# EasyEDA Pro project USB Hub.epro

# Schematic Schematic1
Board Name: Board1; Create Date: 2026-03-24; Page Name: P1; Project Name: USB Hub; Schematic Name: Schematic1; Update Date: 2026-03-24; Company: EasyEDA.com; Page Size: A4; Version: V1.0
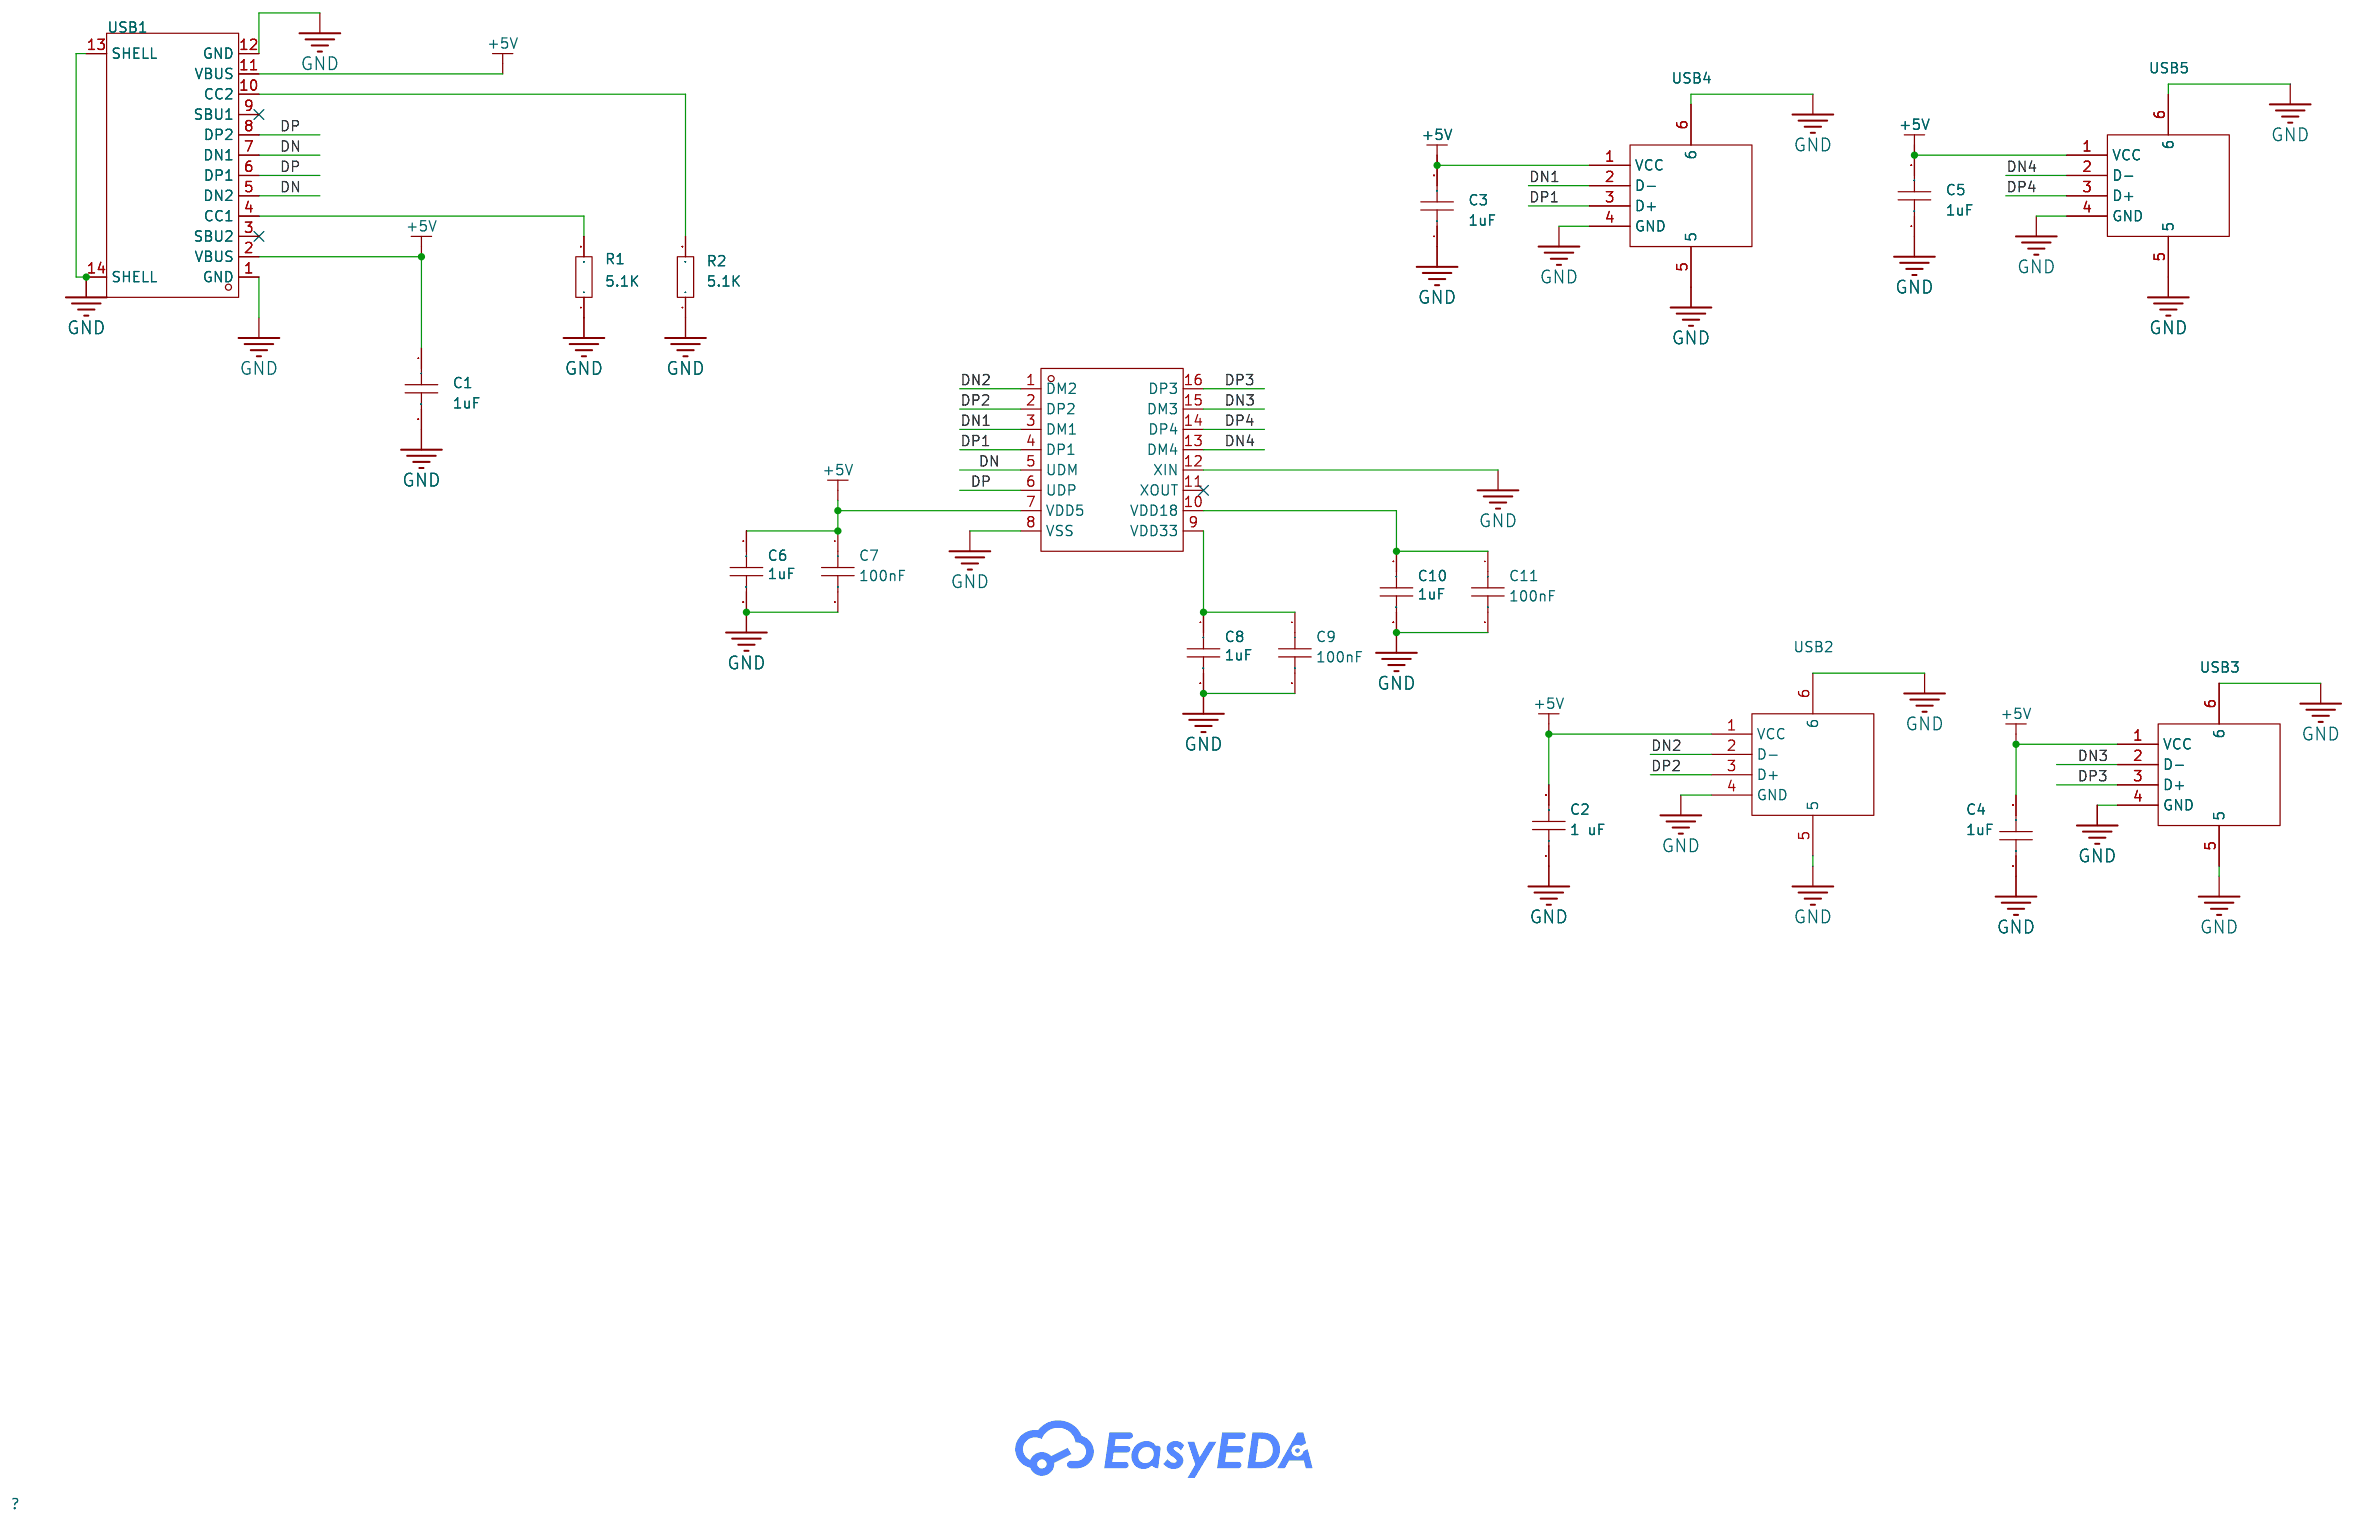
[diagram p0: schematic sheet]

## Parts
C1  100nF  [C0603]
C2  1 uF  [C0603]
C3  100nF  [C0603]
C4  100nF  [C0603]
C5  100nF  [C0603]
C6  100nF  [C0603]
C7  100nF  [C0603]
C8  100nF  [C0603]
C9  100nF  [C0603]
C10  100nF  [C0603]
C11  100nF  [C0603]
R1  10K  [R0603]
R2  10K  [R0603]
U1  SL2.1s  [SSOP-16_L4.6-W2.6-P0.53-LS4.0-BL]
USB1  TYPE-C 16PIN 2MD(073)  [USB-C-SMD_TYPE-C-6PIN-2MD-073]
USB2  10.0 QHHTZB6.3  [USB-A-TH_10.0QHHTZB6.3]
USB3  10.0 QHHTZB6.3  [USB-A-TH_10.0QHHTZB6.3]
USB4  10.0 QHHTZB6.3  [USB-A-TH_10.0QHHTZB6.3]
USB5  10.0 QHHTZB6.3  [USB-A-TH_10.0QHHTZB6.3]

## Library data of the parts
C1-C11 = CAP_0603: Supplier Footprint: 0603
R1 R2 = Res_0603: Supplier Footprint: 0603
U1 = SL2.1s: type:Hub USB Protocol:USB 2.0 Voltage - Supply:4V~5.25V Voltage - Supply:4V~5.25V Operating Temperature:0℃~+70℃ Operating Temperature:0℃~+70℃ Current - Supply:120mA Quiescent Supply Current:2.5mA Number of Channels:4; LCSC Part Name: USB2.0 HUB控制器集成电路; Supplier Part: C2684433; Manufacturer: CoreChips(和芯润德); Supplier Footprint: SSOP-16; JLCPCB Part Class: Extended Part; Datasheet: https://item.szlcsc.com/datasheet/SL2.1s/2782346.html; Supplier: LCSC; type: Hub; USB Protocol: USB 2.0; Voltage - Supply: 4V~5.25V; Operating Temperature: 0℃~+70℃; Current - Supply: 120mA; Quiescent Supply Current: 2.5mA; Number of Channels: 4
USB1 = TYPE-C 16PIN 2MD(073): Connector Type:Type-C Protocol Standard:- Gender:Female Mounting Type:Surface Mount, Right Angle Number of Contacts:16P Number of Ports:1 Current Rating-Power:3A Voltage Rating:5V Connect-Disconnect Life:5,000 times Supplementary Features:- Center Height:; LCSC Part Name: 16P卧贴母座; Supplier Part: C2765186; Manufacturer: SHOU HAN(首韩); Supplier Footprint: SMD; JLCPCB Part Class: Extended Part; Datasheet: https://item.szlcsc.com/datasheet/TYPE-C%252016PIN%25202MD(073)/2901843.html; Supplier: LCSC; Connector Type: Type-C; Gender: Female; Mounting Type: Surface Mount, Right Angle; Number of Contacts: 16P; Number of Ports: 1; Current Rating-Power: 3A; Voltage Rating: 5V; Connect-Disconnect Life: 5,000 times; Detection color: Black; Operating Temperature: -25℃~+85℃
USB2-USB5 = 10.0 QHHTZB6.3: Connector Type:Type-A Protocol Standard:USB 2.0 Gender:Female Mounting Type:Surface Mount, Right Angle Number of Contacts:4P Number of Ports:1 Current Rating-Power:1.5A Voltage Rating:30V Connect-Disconnect Life:5,000 times Supplementary Features:- Center; LCSC Part Name: 壳长10.0mm; Supplier Part: C668591; Manufacturer: SHOU HAN(首韩); Supplier Footprint: SMD; JLCPCB Part Class: Extended Part; Datasheet: https://item.szlcsc.com/datasheet/10.0%2520QHHTZB6.3/698534.html; Supplier: LCSC; Connector Type: Type-A; Protocol Standard: USB 2.0; Gender: Female; Mounting Type: Surface Mount, Right Angle; Number of Contacts: 4P; Number of Ports: 1; Current Rating-Power: 1.5A; Voltage Rating: 30V; Connect-Disconnect Life: 5,000 times; Length: 10mm; Detection color: Black; Operating Temperature: -25℃~+85℃

## Nets
+5V: C1.1 C2.2 C3.2 C4.2 C5.2 C6.1 C7.1 U1.7(VDD5) USB1.2(VBUS) USB1.11(VBUS) USB2.1(VCC) USB3.1(VCC) USB4.1(VCC) USB5.1(VCC)
GND: C1.2 C2.1 C3.1 C4.1 C5.1 C6.2 C7.2 C8.2 C9.2 C10.2 C11.2 R1.1 R2.1 U1.8(VSS) U1.12(XIN) USB1.1(GND) USB1.12(GND) USB1.13(SHELL) USB1.14(SHELL) USB2.4(GND) USB2.5 USB2.6 USB3.4(GND) USB3.5 USB3.6 USB4.4(GND) USB4.5 USB4.6 USB5.4(GND) USB5.5 USB5.6
DN: U1.5(UDM) USB1.5(DN2) USB1.7(DN1)
DN1: U1.3(DM1) USB4.2(D-)
DN2: U1.1(DM2) USB2.2(D-)
DN3: U1.15(DM3) USB3.2(D-)
DN4: U1.13(DM4) USB5.2(D-)
DP: U1.6(UDP) USB1.6(DP1) USB1.8(DP2)
DP1: U1.4(DP1) USB4.3(D+)
DP2: U1.2(DP2) USB2.3(D+)
DP3: U1.16(DP3) USB3.3(D+)
DP4: U1.14(DP4) USB5.3(D+)
$1N2464: C8.1 C9.1 U1.9(VDD33)
$1N2541: C10.1 C11.1 U1.10(VDD18)
$1N2759: R1.2 USB1.4(CC1)
$1N2783: R2.2 USB1.10(CC2)

Not connected (* = marked no-connect by the designer): U1 11(XOUT)*; USB1 3(SBU2)* 9(SBU1)*

# Board PCB1
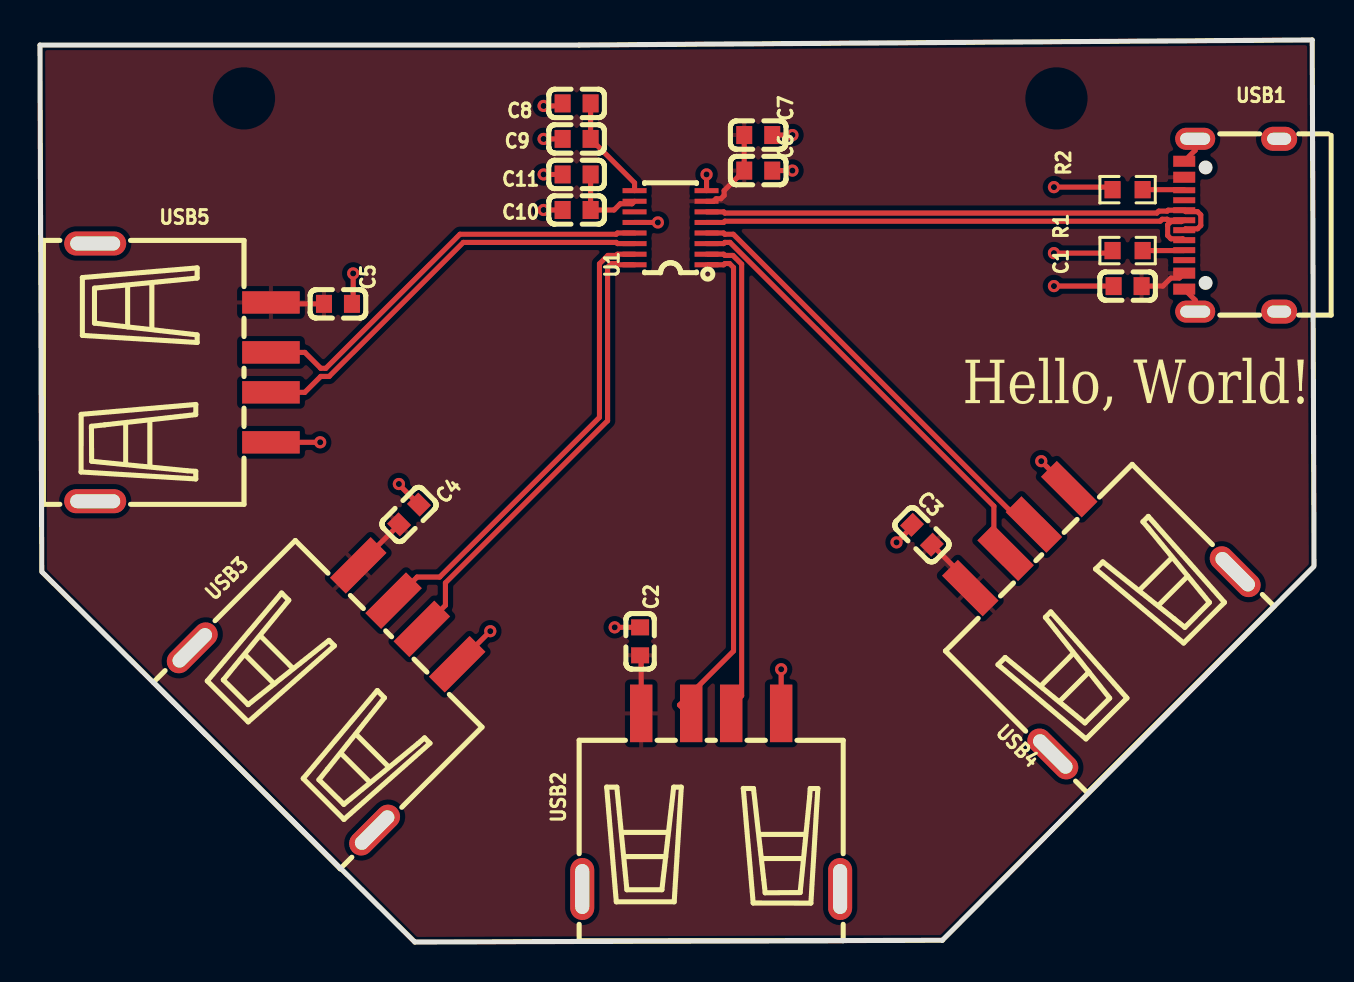
[diagram p1: board, top side]
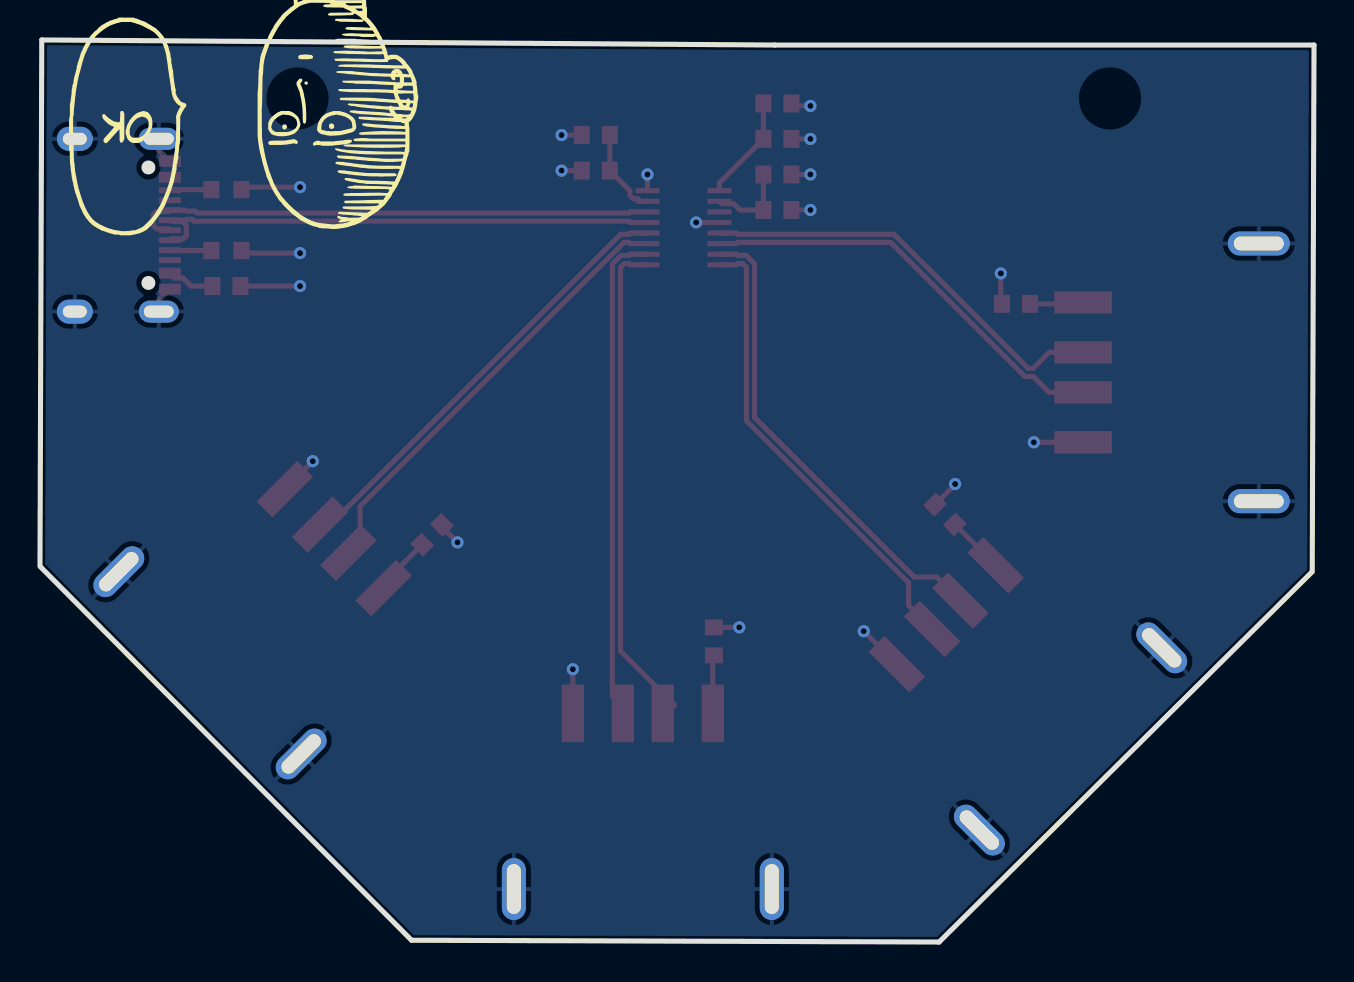
[diagram p2: board, bottom side, seen from below]

Outline 63.73 x 45.15 mm; copper layers: Top Layer, Bottom Layer. Coordinates in mm from the lower left corner of the outline.
Outline path: 0.09,18.53 0,44.9 26.97,44.9 63.64,45.15 63.73,18.81 ; 0.12,18.51 18.75,0 45.14,0.09 63.68,18.76
Stack: Top Layer 0.035mm / Dielectric1 1.51mm FR4 er 4.5 / Bottom Layer 0.035mm

## Design rules (mm)
net DN2: DP3
net DP2: DP3
net DN1: DP2
net DP1: DP2
net DN: DP1
net DP: DP1
net DN4: DP5
net DP4: DP5
net DN3: DP4
net DP3: DP4
template: Custom Config
spacing copperThickness1oz (default): track to track 0.102, other pairs 0.152 to 0.3
spacing copperThickness2oz: track to track 0.203, other pairs 0.152 to 0.3
track width copperThickness1oz (default): min 0.127, default 0.254, max 2.54
track width copperThickness2oz: min 0.203, default 0.254, max 2.54
differential pair differentialPair (default): width min 0.127, default 0.254, max 2.54; gap min 0.152, default 0.152
via viaSize (default): diameter min 0.5, default 0.61, max 10; hole min 0.3, default 0.305, max 6.3

## Placement (name value [footprint] x y rotation side)
C1  100nF  [C0603]  54.4 32.83 180 top
C2  1 uF  [C0603]  30.02 15.05 270 top
C3  100nF  [C0603]  44.11 20.38 315 top
C4  100nF  [C0603]  18.46 21.4 225 top
C5  100nF  [C0603]  14.9 31.94 180 top
C6  100nF  [C0603]  35.93 40.39 0 top
C7  100nF  [C0603]  35.93 38.61 0 top
C8  100nF  [C0603]  26.84 41.97 180 top
C9  100nF  [C0603]  26.84 40.2 180 top
C10  100nF  [C0603]  26.84 36.64 180 top
C11  100nF  [C0603]  26.84 38.42 180 top
R1  10K  [R0603]  54.4 34.61 0 top
R2  10K  [R0603]  54.4 37.66 0 top
U1  SL2.1s  [SSOP-16_L4.6-W2.6-P0.53-LS4.0-BL]  31.54 35.75 90 top
USB1  TYPE-C 16PIN 2MD(073)  [USB-C-SMD_TYPE-C-6PIN-2MD-073]  59.61 35.88 90 top
USB2  10.0 QHHTZB6.3  [USB-A-TH_10.0QHHTZB6.3]  33.57 7.05 0 top
USB3  10.0 QHHTZB6.3  [USB-A-TH_10.0QHHTZB6.3]  15.29 13.27 315 top
USB4  10.0 QHHTZB6.3  [USB-A-TH_10.0QHHTZB6.3]  52.12 17.08 45 top
USB5  10.0 QHHTZB6.3  [USB-A-TH_10.0QHHTZB6.3]  7.16 28.51 270 top

## Footprints (pads in the part's own frame, mm; a bottom-side part is the same pattern mirrored in y, then rotated)
C0603
  rect 0.8x0.9 smd: 1(-0.7,0) 2(0.7,0)
R0603
  rect 0.806x0.864 smd: 1(-0.753,0) 2(0.753,0)
SSOP-16_L4.6-W2.6-P0.53-LS4.0-BL
  rect 0.25x1.2 smd: 1(-1.855,-1.8) 2(-1.325,-1.8) 3(-0.795,-1.8) 4(-0.265,-1.8) 5(0.265,-1.8) 6(0.795,-1.8) 7(1.325,-1.8) 8(1.855,-1.8) 9(1.855,1.8) 10(1.325,1.8) 11(0.795,1.8) 12(0.265,1.8) 13(-0.265,1.8) 14(-0.795,1.8) 15(-1.325,1.8) 16(-1.855,1.8)
USB-A-TH_10.0QHHTZB6.3
  rect 1.12x2.88 smd: 1(-3.5,4.395) 2(-1,4.395) 3(1,4.395) 4(3.5,4.395)
  oval 1.2x3.1 hole 0.7x2.5: 5(-6.45,-4.395) 6(6.45,-4.395)
USB-C-SMD_TYPE-C-6PIN-2MD-073
  rect 0.55x1.1 smd: 1(-3.2,2.375) 2(-2.4,2.375) 11(2.4,2.375) 12(3.2,2.375)
  rect 0.3x1.1 smd: 3(-1.75,2.375) 4(-1.25,2.375) 5(-0.75,2.375) 6(-0.25,2.375) 7(0.25,2.375) 8(0.75,2.375) 9(1.25,2.375) 10(1.75,2.375)
  oval 1.1x2 hole 0.6x1.5: 13(-4.325,1.825) 14(4.325,1.825)
  oval 1.2x1.8 hole 0.6x1.2: 13(-4.325,-2.375) 14(4.325,-2.375)

## Nets
As in the schematic.

Pads without a net: U1 11; USB1 3 9

## Via types
v1: diameter 0.61, hole 0.305, Top Layer to Bottom Layer, 19 vias

## Routing (per net, layer and track width the routed paths; a pad name or vN(x,y) marks a point on that pad's centre or on a via; arc(x,y) is an arc through that point)
+5V: length 18.3
  Top Layer w0.254: USB5.1 11.62,31.94 C5.2 ; USB2.1 30.07,14.29 C2.2 ; C6.1 C7.1 34.22,37.61 34.22,37.37 34.06,37.2 33.82,37.2 33.69,37.08 U1.7 ; C4.2 17.97,20.9 15.92,18.85 ; USB4.1 46.53,17.97 C3.2 ; C1.1 56.17,32.83 56.57,33.23 56.99,33.23 USB1.2
GND: length 34
  Top Layer w0.254: USB1.12 57.78,39.63 USB1.14 ; v1(50.08,24.07) 50.08,24.06 51.48,22.66 ; C9.2 v1(25.19,40.2) ; USB1.13 57.78,32.13 USB1.1 ; v1(25.19,41.85) 26.02,41.85 C8.2 ; C7.2 v1(37.64,38.61) ; C10.2 v1(25.19,36.64) ; U1.8 v1(33.34,38.42) ; C1.2 v1(50.72,32.83) ; C6.2 v1(37.64,40.39) ; C3.1 43.62,20.78 v1(42.84,20) ; USB2.4 v1(37.07,13.65) ; C11.2 v1(25.19,38.42) ; R2.1 53.52,37.78 v1(50.72,37.78) ; v1(22.52,15.56) 20.87,13.91 20.87,13.91 ; U1.12 v1(30.91,36.02) ; R1.1 53.52,34.48 v1(50.72,34.48) ; USB5.4 v1(14.02,25.01) ; v1(17.95,22.92) 17.95,22.9 C4.1 ; v1(15.67,33.47) 15.67,32 C5.1 ; C2.1 v1(28.75,15.75)
DN: length 26.4
  Top Layer w0.254: USB1.5 57.16,35.2 56.57,35.2 56.4,35.36 56.4,35.89 56.57,36.06 57.09,36.06 57.14,36.11 57.21,36.11 USB1.7 56.43,36.13 56.38,36.18 56.13,36.18 56.03,36.08 34.26,36.08 34.2,36.02 U1.5
DN1: length 22.4
  Top Layer w0.254: USB4.2 47.71,20.07 47.71,21.81 34.51,35.02 34.26,35.02 34.2,34.96 U1.3
DN2: length 25.2
  Top Layer w0.254: USB2.2 32.4,11.44 31.99,11.86 34.69,14.57 34.69,33.76 34.49,33.96 34.26,33.96 34.2,33.9 U1.1
DN3: length 23.7
  Top Layer w0.254: U1.15 28.89,34.43 28.83,34.36 28.4,34.36 27.99,33.95 27.99,26.26 19.99,18.27 18.87,18.27 USB3.2
DN4: length 21.3
  Top Layer w0.254: U1.13 28.89,35.49 28.83,35.42 21.01,35.42 14.3,28.72 14.04,28.72 13.25,29.51 USB5.2
DP: length 26.4
  Top Layer w0.254: U1.6 34.2,36.55 34.26,36.48 55.86,36.48 55.96,36.58 56.38,36.58 56.43,36.63 USB1.8 57.3,36.56 57.9,36.56 58.06,36.39 58.06,35.86 57.9,35.7 57.3,35.7 USB1.6
DP1: length 22.4
  Top Layer w0.254: U1.4 34.2,35.49 34.26,35.42 34.68,35.42 49.21,20.9 49.71,20.9
DP2: length 24.7
  Top Layer w0.254: U1.2 34.2,34.43 34.26,34.36 34.66,34.36 35.1,33.93 35.1,12.33 34.57,11.8 USB2.3
DP3: length 23.4
  Top Layer w0.254: 19.1,15.67 20.28,16.85 20.28,17.98 28.39,26.09 28.39,33.78 28.57,33.96 28.83,33.96 28.89,33.9 U1.16
DP4: length 21.3
  Top Layer w0.254: USB5.3 13.25,27.51 14.04,28.31 14.47,28.31 21.17,35.02 28.83,35.02 28.89,34.96 U1.14
$1N2464: length 5.3
  Top Layer w0.254: U1.9 29.74,38 C9.1 C8.1
$1N2541: length 4.2
  Top Layer w0.254: C11.1 C10.1 28.72,36.64 29.03,36.95 29.62,36.95 U1.10
$1N2759: length 2.1
  Top Layer w0.254: USB1.4 57.21,34.61 R1.2
$1N2783: length 2.1
  Top Layer w0.254: USB1.10 57.21,37.66 R2.2

## Copper pours and planes (outline as drawn; the poured copper is in the pictures)
+5V on Top Layer: -4.4,49.72 70.53,49.72 70.53,-1.97 -4.4,-1.97
GND on Bottom Layer: -2.88,47.56 66.34,47.56 66.34,-1.21 -2.88,-1.21

## Text on the board
Top Silkscreen Layer: Hello, World!
